# EAGLE design SparkFun_RFM97CW_Breakout (EAGLE 9.6.2)
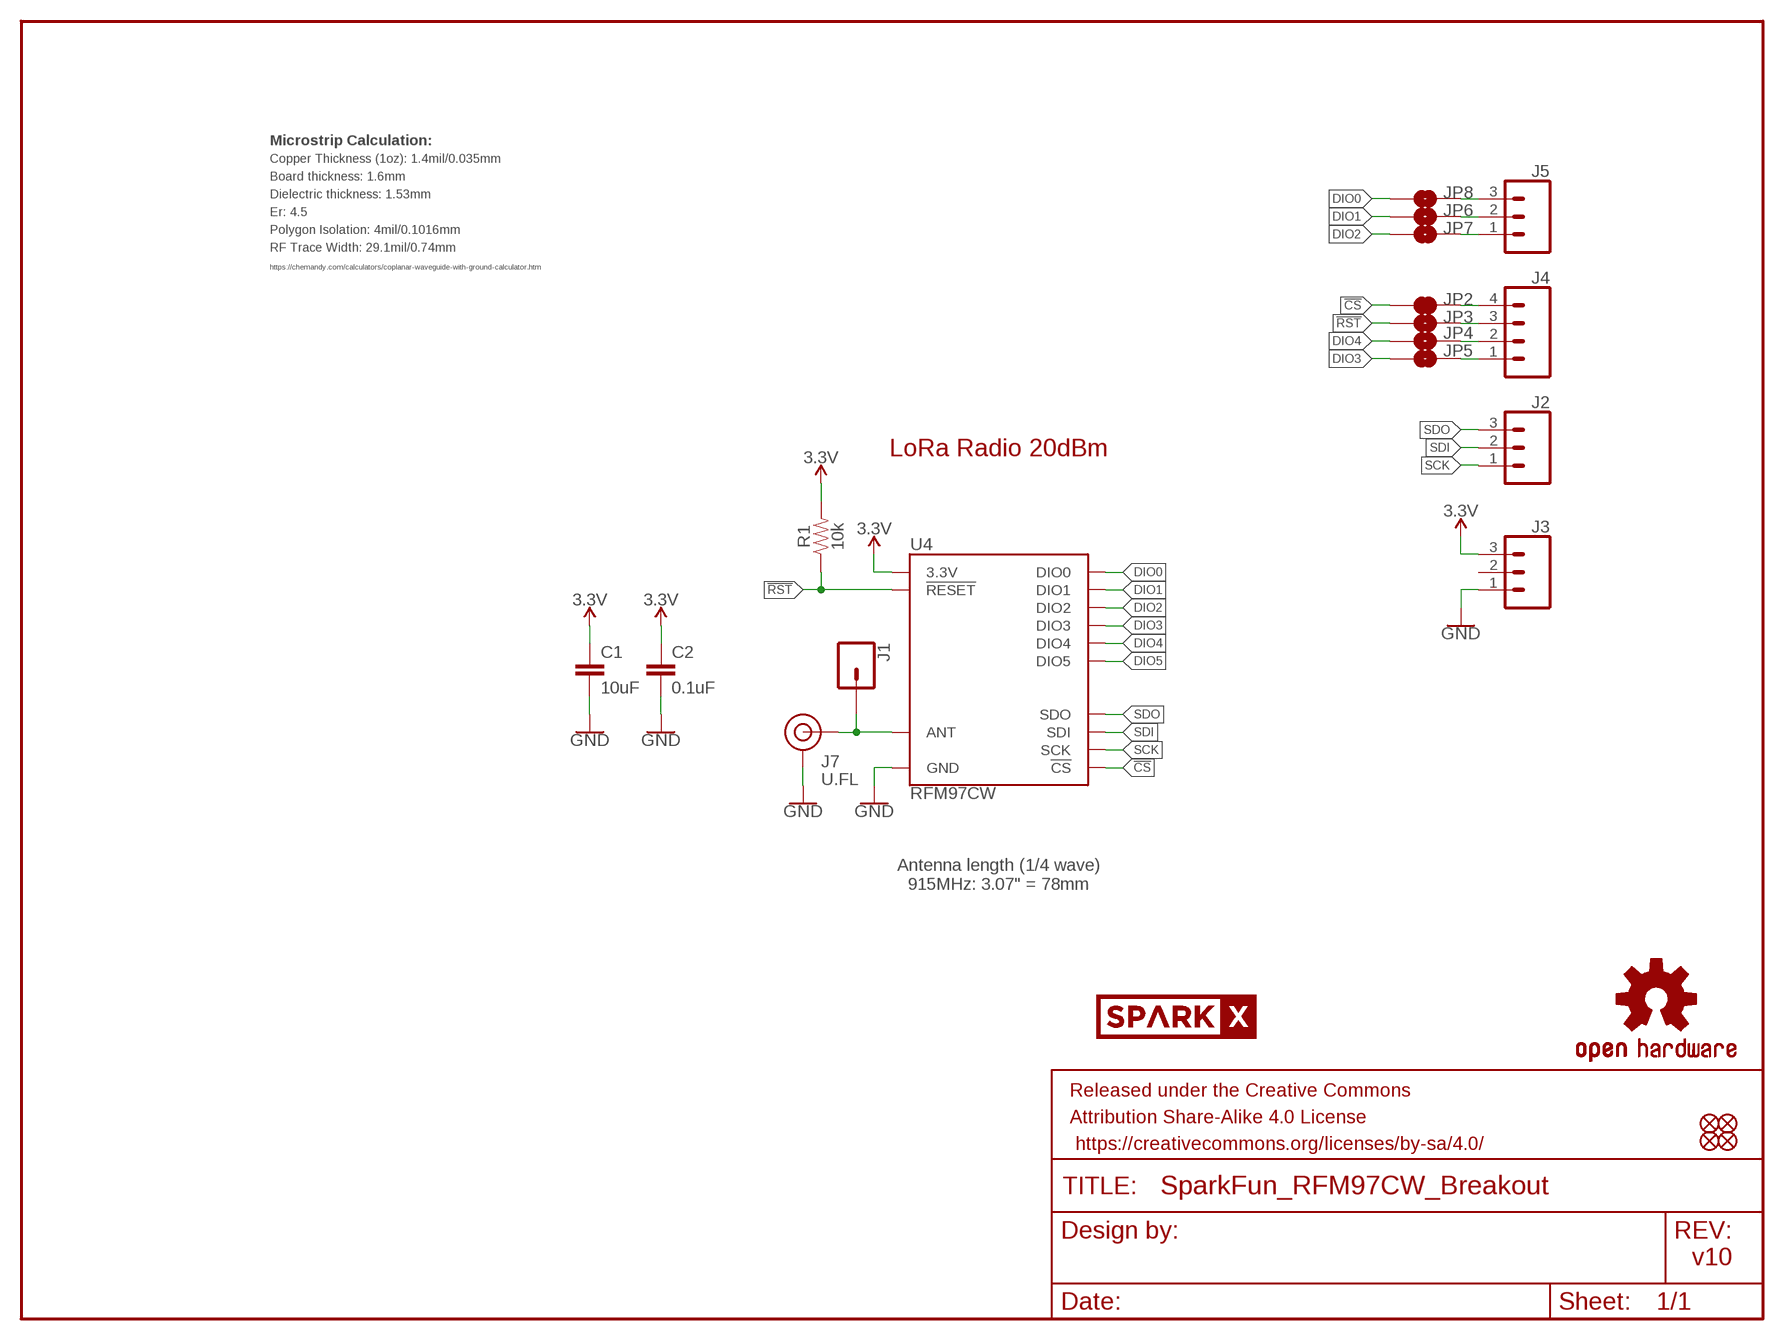
[diagram p0: schematic, sheet 1]

## Parts
C1  10uF  10UF-0603-6.3V-20%  [0603]
C2  0.1uF  0.1UF-0603-25V-(+80/-20%)  [0603]
FID1  FIDUCIAL1X2  [FIDUCIAL-1X2]
FID2  FIDUCIAL1X2  [FIDUCIAL-1X2]
FID3  FIDUCIAL1X2  [FIDUCIAL-1X2]
FID4  FIDUCIAL1X2  [FIDUCIAL-1X2]
FRAME1  FRAME-LETTER  [CREATIVE_COMMONS]
J1  CONN_01PTH_NO_SILK_YES_STOP  [1X01_NO_SILK]
J2  CONN_031X03_NO_SILK  [1X03_NO_SILK]
J3  CONN_031X03_NO_SILK  [1X03_NO_SILK]
J4  CONN_041X04_NO_SILK  [1X04_NO_SILK]
J5  CONN_031X03_NO_SILK  [1X03_NO_SILK]
J7  U.FL  U.FL2PIN  [U.FL]
JP2  JUMPER-SMT_2_NC_TRACE_NO-SILK  [SMT-JUMPER_2_NC_TRACE_NO-SILK]
JP3  JUMPER-SMT_2_NO_NO-SILK  [SMT-JUMPER_2_NO_NO-SILK]
JP4  JUMPER-SMT_2_NO_NO-SILK  [SMT-JUMPER_2_NO_NO-SILK]
JP5  JUMPER-SMT_2_NO_NO-SILK  [SMT-JUMPER_2_NO_NO-SILK]
JP6  JUMPER-SMT_2_NO_NO-SILK  [SMT-JUMPER_2_NO_NO-SILK]
JP7  JUMPER-SMT_2_NO_NO-SILK  [SMT-JUMPER_2_NO_NO-SILK]
JP8  JUMPER-SMT_2_NO_NO-SILK  [SMT-JUMPER_2_NO_NO-SILK]
LOGO2  OSHW-LOGOS  [OSHW-LOGO-S]
R1  10k  10KOHM-0603-1/10W-1%  [0603]
U4  RFM97CW  RFM9XRFM97  [RFM97]
U$22  SPARKX-LOGO5  [SPARKX-LARGE]

## Nets
3.3V: C1.1 C2.1 J3.3 R1.2 U4.3V3(3.3V)
!CS!: JP2.1 U4.!CS!
!RST!: JP3.1 R1.1 U4.!RST(!RESET)
ANT: J1.1 J7.FEED(SIGNAL) U4.ANT
DIO0: JP8.1 U4.DIO0
DIO1: JP6.1 U4.DIO1
DIO2: JP7.1 U4.DIO2
DIO3: JP5.1 U4.DIO3
DIO4: JP4.1 U4.DIO4
DIO5: U4.DIO5
GND: C1.2 C2.2 J3.1 J7.1(GND) J7.2(GND) U4.GND U4.GND@1(GND) U4.GND@2(GND)
N$1: J5.3 JP8.2
N$2: J4.4 JP2.2
N$3: J4.3 JP3.2
N$7: J4.2 JP4.2
N$8: J4.1 JP5.2
N$9: J5.2 JP6.2
N$10: J5.1 JP7.2
SCK: J2.1 U4.SCK
SDI: J2.2 U4.SDI
SDO: J2.3 U4.SDO
Unconnected: J3.2

## Notes on the sheet
- Microstrip Calculation:
- Copper Thickness (1oz): 1.4mil/0.035mm
- Board thickness: 1.6mm
- Dielectric thickness: 1.53mm
- Er: 4.5
- Polygon Isolation: 4mil/0.1016mm
- RF Trace Width: 29.1mil/0.74mm
- https://chemandy.com/calculators/coplanar-waveguide-with-ground-calculator.htm
- LoRa Radio 20dBm
- Antenna length (1/4 wave)
  915MHz: 3.07" = 78mm
- v10

## Library data of the parts
C1 = SparkFun-Capacitors:10UF: 10.0µF ceramic capacitors A capacitor is a passive two-terminal electrical component used to store electrical energy temporarily in an electric field.; PROD_ID: CAP-11015
C2 = SparkFun-Capacitors:0.1UF: 0.1µF ceramic capacitors A capacitor is a passive two-terminal electrical component used to store electrical energy temporarily in an electric field.; PROD_ID: CAP-00810
FID1-FID4 = SparkFun-Aesthetics:FIDUCIAL: Fiducial Alignment Points Point-of-reference for pick-and-place machines and other optical instruments.
FRAME1 = SparkFun-Aesthetics:FRAME-LETTER: Schematic Frame - Letter Standard 8.5x11 US Letter frame
J1 = SparkFun-Connectors:CONN_01: Single connection point. Often used as Generic Header-pin footprint for 0.1 inch spaced/style header connections On any of the 0.1 inch spaced packages, you can populate with these: Break Away Headers - Straight <https://www.sparkfun.com/products/116> (PRT-00116) Break Away Male Headers - Right Angle <https://www.sparkfun.com/products/553> (PRT-00553) Female Headers <https://www.sparkfun.com/products/115> (PRT-00115) Break Away Headers - Machine Pin <https://www.sparkfun.com/products/117> (PRT-00117) Break Away Female Headers - Swiss Machine Pin <https://www.sparkfun.com/products/743> (PRT-00743) This device is also useful as a general connection point to wire up your design to another part of your project. Our various solder wires solder well into these plated through hole pads. Hook-Up Wire - Assortment (Stranded, 22 AWG) <https://www.sparkfun.com/products/11375> (PRT-11375) Hook-Up Wire - Assortment (Solid Core, 22 AWG) <https://www.sparkfun.com/products/11367> (PRT-11367) View the entire wire category on our website here <https://www.sparkfun.com/categories/141> Special notes: SMTSO-256-ET is a "flush mount" nut for a 4-40 screw. We mostly use this on specialty testbeds; it is a nice way to connect hardware to your PCB at an adjustable hieght. Also note, the SNAP packages are for using a snappable style connector. We sell a baggie of snaps and they are also used on two LilyPad designs: Snap Assortment - 30 pack (male and female) <https://www.sparkfun.com/products/11347> (DEV-11347) LilyPad Arduino SimpleSnap <https://www.sparkfun.com/products/10941> (DEV-10941) LilyPad SimpleSnap Protoboard <https://www.sparkfun.com/products/10940> (DEV-10940)
J2 J3 J5 = SparkFun-Connectors:CONN_03: Multi connection point. Often used as Generic Header-pin footprint for 0.1 inch spaced/style header connections On any of the 0.1 inch spaced packages, you can populate with these: Break Away Headers - Straight <https://www.sparkfun.com/products/116> (PRT-00116) Break Away Male Headers - Right Angle <https://www.sparkfun.com/products/553> (PRT-00553) Female Headers <https://www.sparkfun.com/products/115> (PRT-00115) Break Away Headers - Machine Pin <https://www.sparkfun.com/products/117> (PRT-00117) Break Away Female Headers - Swiss Machine Pin <https://www.sparkfun.com/products/743> (PRT-00743) Stackable Header - 3 Pin (Female, 0.1") <https://www.sparkfun.com/products/13875> (PRT-13875) For SCREWTERMINALS and SPRING TERMINALS visit here: Screw Terimnals on SparkFun.com <https://www.sparkfun.com/search/results?term=Screw+Terminals> (5mm/3.5mm/2.54mm spacing) This device is also useful as a general connection point to wire up your design to another part of your project. Our various solder wires solder well into these plated through hole pads. Hook-Up Wire - Assortment (Stranded, 22 AWG) <https://www.sparkfun.com/products/11375> (PRT-11375) Hook-Up Wire - Assortment (Solid Core, 22 AWG) <https://www.sparkfun.com/products/11367> (PRT-11367) View the entire wire category on our website here <https://www.sparkfun.com/categories/141> Special notes: Molex polarized connector foot print use with SKU : PRT-08232 with associated crimp pins and housings.
J4 = SparkFun-Connectors:CONN_04: Multi connection point. Often used as Generic Header-pin footprint for 0.1 inch spaced/style header connections On any of the 0.1 inch spaced packages, you can populate with these: Break Away Headers - Straight <https://www.sparkfun.com/products/116> (PRT-00116) Break Away Male Headers - Right Angle <https://www.sparkfun.com/products/553> (PRT-00553) Female Headers <https://www.sparkfun.com/products/115> (PRT-00115) Break Away Headers - Machine Pin <https://www.sparkfun.com/products/117> (PRT-00117) Break Away Female Headers - Swiss Machine Pin <https://www.sparkfun.com/products/743> (PRT-00743) For SCREWTERMINALS and SPRING TERMINALS visit here: Screw Terimnals on SparkFun.com <https://www.sparkfun.com/search/results?term=Screw+Terminals> (5mm/3.5mm/2.54mm spacing) This device is also useful as a general connection point to wire up your design to another part of your project. Our various solder wires solder well into these plated through hole pads. Hook-Up Wire - Assortment (Stranded, 22 AWG) <https://www.sparkfun.com/products/11375> (PRT-11375) Hook-Up Wire - Assortment (Solid Core, 22 AWG) <https://www.sparkfun.com/products/11367> (PRT-11367) View the entire wire category on our website here <https://www.sparkfun.com/categories/141> Special notes: Molex polarized connector foot print use with SKU : PRT-08231 with associated crimp pins and housings. 1MM SMD Version SKU: PRT-10208; PROD_ID: CONN-09696
J7 = SparkFun-Connectors:U.FL2PIN: SMD Antenna Connector - U.FL 2mm height, 3.0mm x 3.0mm receptacle size. SparkFun Products: SparkFun WiFi Shield - ESP8266 <https://www.sparkfun.com/products/13287> SparkFun ESP8266 Thing <https://www.sparkfun.com/products/13231> SparkFun MiniGen - Pro Mini Signal Generator Shield <https://www.sparkfun.com/products/11420>; PROD_ID: CONN-09193; SF_ID: WRL-09144
JP2 = SparkFun-Jumpers:JUMPER-SMT_2_NC_TRACE: Normally closed trace jumper This jumper has a trace between two pads so it's normally closed (NC). Use a razor knife to open the connection. For best results follow the IPC guidelines for cutting traces: Cutout at least 0.063 mm (0.005 in). Remove all loose material to clean up the cut area. Seal the cut with an approved epoxy. Reapply solder to reclose the connection.
JP3-JP8 = SparkFun-Jumpers:JUMPER-SMT_2_NO: Normally open jumper This jumper has two pads in close proximity to each other. Apply solder to close the connection. Round pads are easier to solder for beginners, but are a lot larger. SparkFun Product that uses the round pads: SparkFun EL Sequencer <https://www.sparkfun.com/products/12781>
LOGO2 = SparkFun-Aesthetics:OSHW-LOGO: Open-Source Hardware (OSHW) Logo This logo indicates the piece of hardware it is found on incorporates a OSHW license and/or adheres to the definition of open source hardware found here: http://freedomdefined.org/OSHW
R1 = SparkFun-Resistors:10KOHM: 10kΩ resistor A resistor is a passive two-terminal electrical component that implements electrical resistance as a circuit element. Resistors act to reduce current flow, and, at the same time, act to lower voltage levels within circuits. - Wikipedia; PROD_ID: RES-00824
U4 = SparkFun-RF:RFM9X: RFM95/96/97/98 The RFM95/96/97/98(W) transceivers feature the LoRaTM long range modem that provides ultra-long range spread spectrum communication and high interference immunity whilst minimising current consumption. These devices also support high performance (G)FSK modes for systems including WMBus, IEEE802.15.4g. The RFM95/96/97/98(W) deliver exceptional phase noise, selectivity, receiver linearity and IIP3 for significantly lower current consumption than competing devices Datasheet <http://www.hoperf.com/upload/rf/RFM95_96_97_98W.pdf>
U$22 = SparkX:SPARKX-LOGO

## Board
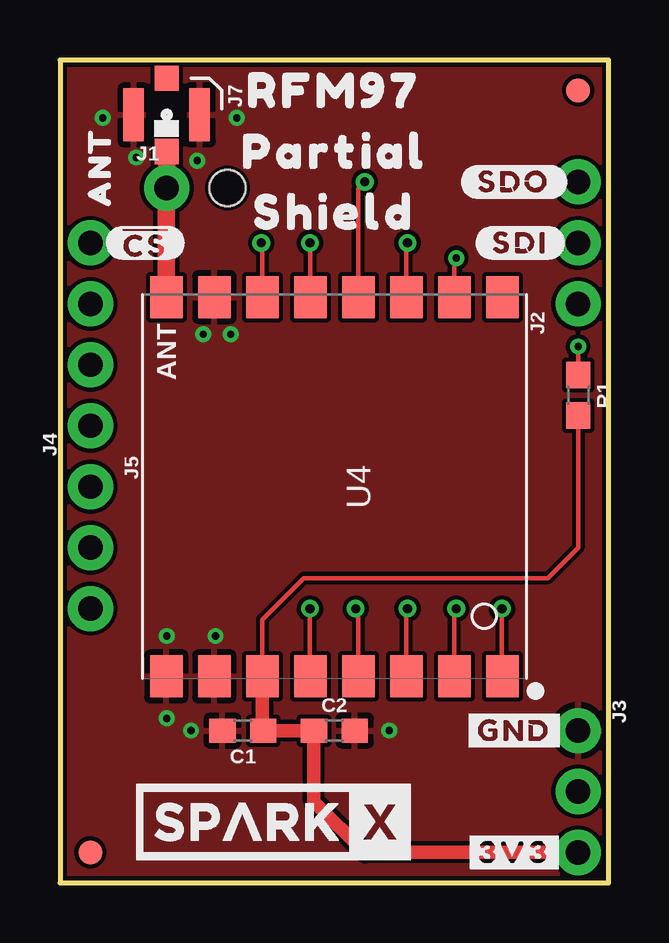
[diagram p1: board, top side]
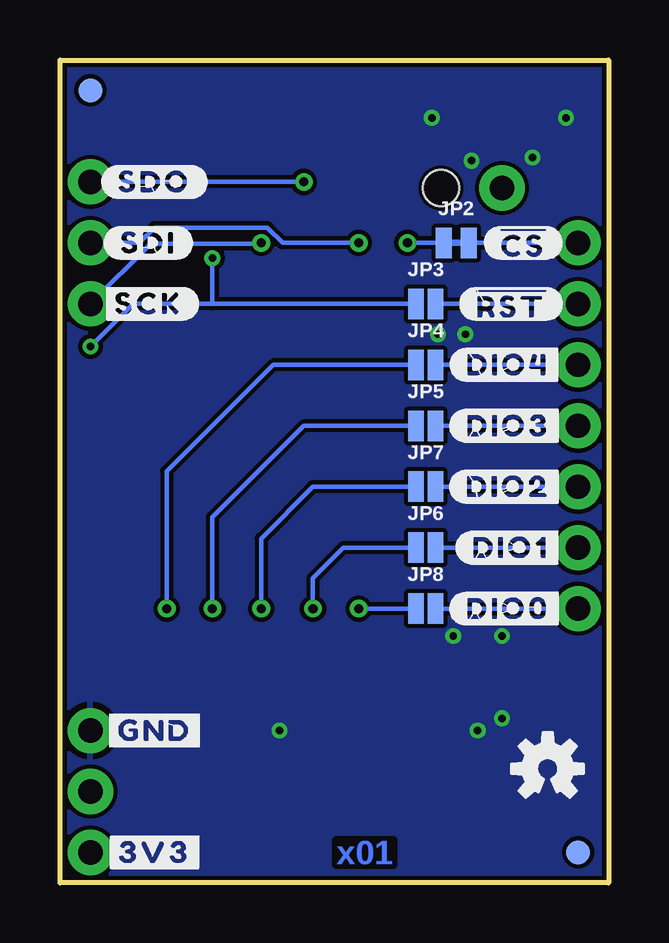
[diagram p2: board, bottom side, seen from below]

Size 22.86 x 34.29 mm. Coordinates in mm from the lower left corner, seen from the top.
Outline: 0,0 22.86,0 22.86,34.29 0,34.29 0,0
Copper layers (1*16): Top 0.035mm / dielectric 1.5mm / Bottom 0.035mm
Design rules "SparkFun-2-Layer-General-JLCPCB": minimum track width 7mil, minimum drill 0.3mm, track to track 7mil, track to pad 7mil, pad to pad 7mil, via to via 7mil, smd to smd 7mil, copper to edge 7mil, drill to drill 7mil, minimum pad ring 7mil, minimum via ring 7mil, stop-mask expansion 3mil, vias tented up to drill 25mil, thermal gap 10mil
Holes 1.5 mm at 6.99,28.96
tRestrict: area 3.7,31.1 to 5.2,32.9

### Footprints (pad centres in the part's own frame; a part is rotated, then mirrored left to right if it is on the bottom)
0603 = smd 1.1 x 1: 1 -0.85,0; 2 0.85,0
FIDUCIAL-1X2 = smd 1 x 1: 1 0,0
1X01_NO_SILK = drill 1.016 pad 1.88: 1 0,0
1X03_NO_SILK = drill 1.016 pad 1.88: 1 0,0; 2 2.54,0; 3 5.08,0
1X04_NO_SILK = drill 1.016 pad 1.88: 1 0,0; 2 2.54,0; 3 5.08,0; 4 7.62,0
U.FL = smd 2.2 x 0.85: 1 0,1.375; 2 0,-1.375 | smd 1.05 x 1: FEED 1.525,0; NC -1.525,0
SMT-JUMPER_2_NC_TRACE_NO-SILK = smd 0.66 x 1.27: 1 -0.521,0; 2 0.521,0
SMT-JUMPER_2_NO_NO-SILK = smd 0.635 x 1.27: 1 -0.406,0; 2 0.406,0
RFM97 = smd 1.75 x 1.35: 3V3 7.9,-3; !CS! -7.9,-3; !RST -7.9,5; ANT -7.9,-7; DIO0 7.9,-1; DIO1 7.9,1; DIO2 7.9,3; DIO3 7.9,5; DIO4 7.9,7; DIO5 -7.9,7; GND -7.9,-5; GND@1 7.9,-7; GND@2 7.9,-5; SCK -7.9,3; SDI -7.9,-1; SDO -7.9,1

### Placement (x,y rotation side)
C1  7.62,6.35 180 top
C2  11.43,6.35 0 top
FID1  1.27,1.27 0 top
FID2  21.59,33.02 0 top
FID3  1.27,1.27 0 bottom
FID4  21.59,33.02 0 bottom
FRAME1  -15.24,-12.7 0 top  (outside the outline)
J1  4.45,28.96 0 top
J2  21.59,24.13 90 top
J3  21.59,6.35 270 top
J4  1.27,19.05 90 top
J5  1.27,16.51 270 top
J7  4.45,32 270 top
JP2  6.35,26.67 0 bottom
JP3  7.62,24.13 0 bottom
JP4  7.62,21.59 0 bottom
JP5  7.62,19.05 0 bottom
JP6  7.62,13.97 0 bottom
JP7  7.62,16.51 0 bottom
JP8  7.62,11.43 0 bottom
LOGO2  2.54,4.76 0 bottom
R1  21.59,20.32 270 top
U4  11.43,16.51 270 top
U$1  [ANT0]  1.65,29.84 90 top
U$2  [##CS##2]  3.56,26.67 0 bottom
U$3  [#SDO#0]  18.92,29.21 0 top
U$4  [#SDI#1]  19.18,26.67 0 top
U$5  [#SCK#2]  19.18,24.13 0 bottom
U$6  [#SDI#1]  19.18,26.67 0 bottom
U$7  [#SDO#0]  18.92,29.21 0 bottom
U$8  [#3V3#0]  18.92,1.27 0 top
U$9  [#3V3#0]  18.92,1.27 0 bottom
U$10  [#GND#1]  18.92,6.35 0 bottom
U$11  [#GND#1]  18.92,6.35 0 top
U$12  [#DIO0#5]  4.19,11.43 0 bottom
U$13  [#DIO1#4]  4.06,13.97 0 bottom
U$14  [#DIO2#3]  4.19,16.51 0 bottom
U$15  [#DIO3#2]  4.19,19.05 0 bottom
U$16  [#DIO4#1]  4.19,21.59 0 bottom
U$17  [##RST##0]  4.06,24.13 0 bottom
U$18  [PARTIAL1]  11.43,30.48 0 top
U$19  [RFM970]  11.43,33.02 0 top
U$20  [SHIELD2]  11.43,27.94 0 top
U$21  [##CS##2]  3.56,26.67 0 top
U$22  8.89,2.54 0 top

### Tracks (layer width: path | path; a pad name or v marks a point on that pad's centre or on a via)
3.3V
  Top 0.178: R1.2 21.59,13.97 20.32,12.7 10.16,12.7 8.43,10.97 8.43,7.62
  Top 0.559: U4.3V3 8.43,7.62 8.43,6.39 C1.1 C2.1 10.58,3.39 12.7,1.27 J3.3
!CS!  (via drill 0.38)
  Top 0.178: v8.38,26.67 8.43,26.62 U4.!CS!
  Bottom 0.178: JP2.1 v8.38,26.67
!RST!  (via drill 0.3)
  Top 0.178: v21.59,22.35 R1.1 | U4.!RST 16.43,25.95 v16.51,26.04
  Bottom 0.178: JP3.1 16.51,24.13 | 16.51,24.13 19.81,24.13 v21.59,22.35 | v16.51,26.04 16.51,24.13
ANT
  Top 0.739: U4.ANT 4.43,28.94 J1.1 J7.FEED
DIO0  (via drill 0.38)
  Top 0.178: v10.41,11.43 10.41,8.63 U4.DIO0
  Bottom 0.178: JP8.1 v10.41,11.43
DIO1  (via drill 0.38)
  Top 0.178: v12.32,11.43 12.43,11.32 U4.DIO1
  Bottom 0.178: JP6.1 11.05,13.97 12.32,12.7 v12.32,11.43
DIO2  (via drill 0.38)
  Top 0.178: U4.DIO2 14.43,11.38 v14.48,11.43
  Bottom 0.178: JP7.1 12.32,16.51 14.48,14.35 v14.48,11.43
DIO3  (via drill 0.38)
  Top 0.178: U4.DIO3 16.43,11.35 v16.51,11.43
  Bottom 0.178: JP5.1 12.7,19.05 16.51,15.24 v16.51,11.43
DIO4  (via drill 0.38)
  Top 0.178: v18.41,11.43 18.41,8.62 U4.DIO4
  Bottom 0.178: JP4.1 13.97,21.59 18.41,17.14 v18.41,11.43
GND  (via drill 0.3)
  other vias: 6.48,10.29 4.45,10.29 4.45,6.86 5.46,6.35 13.72,6.35 5.97,22.86 7.11,22.86 7.37,31.88 1.78,31.88 3.17,30.23 5.71,30.1
  pour Bottom (isolate 0.102): 0,34.29 22.86,34.29 22.86,0 0,0
  pour Top (isolate 0.102): 0,34.29 22.86,34.29 22.86,0 0,0
N$1
  Bottom 0.178: JP8.2 J5.3
N$2
  Bottom 0.178: JP2.2 J4.4
N$3
  Bottom 0.178: JP3.2 J4.3
N$7
  Bottom 0.178: JP4.2 J4.2
N$8
  Bottom 0.178: JP5.2 J4.1
N$9
  Bottom 0.178: JP6.2 J5.2
N$10
  Bottom 0.178: JP7.2 J5.1
SCK  (via drill 0.38)
  Top 0.178: U4.SCK 14.43,26.62 v14.48,26.67
  Bottom 0.178: v14.48,26.67 14.52,26.63 19.09,26.63 J2.1
SDI  (via drill 0.38)
  Top 0.178: U4.SDI 10.43,26.65 v10.41,26.67
  Bottom 0.178: J2.2 19.55,26.67 18.92,27.3 14.21,27.3 13.58,26.67 v10.41,26.67
SDO  (via drill 0.38)
  Top 0.178: U4.SDO 12.43,28.94 v12.7,29.21
  Bottom 0.178: v12.7,29.21 J2.3

### Text on the board
Bottom: x01